# Altium schematic sheet Connectors.SchDoc
size A
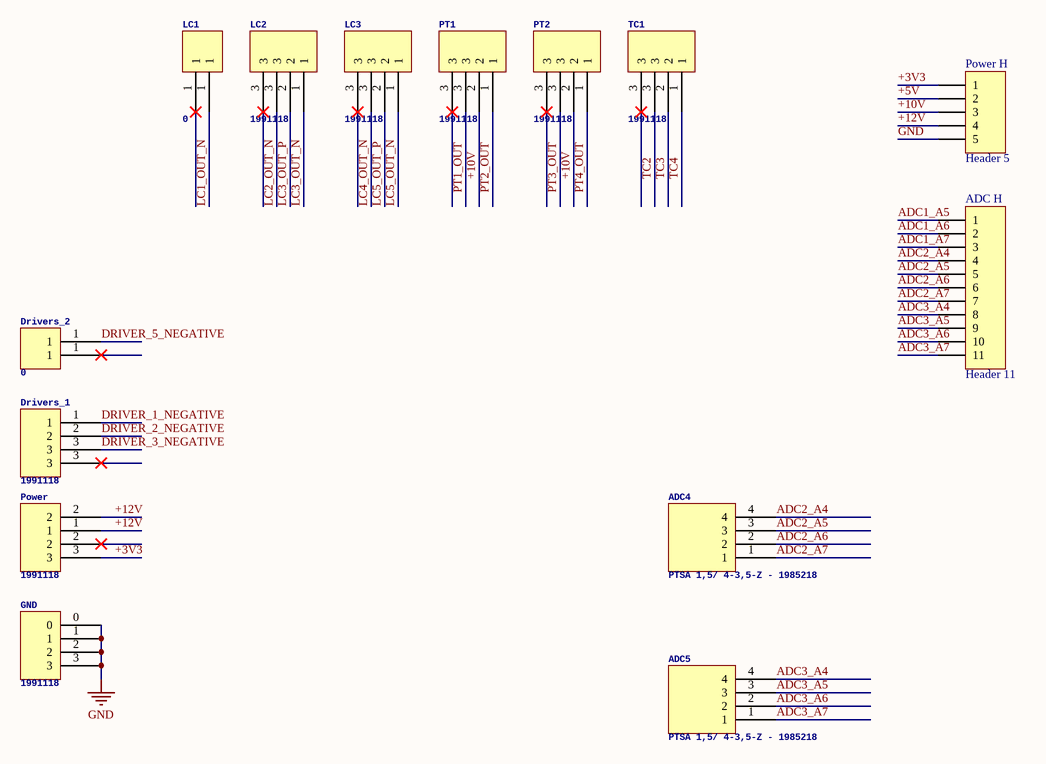
[diagram p0: Connectors.SchDoc]

## Parts
ADC4  PTSA 1,5/ 4-3,5-Z - 1985218
ADC5  PTSA 1,5/ 4-3,5-Z - 1985218
ADC_H  Header 11  [HDR1X11]
Drivers_1  1991118
Drivers_2  0
GND  1991118
LC1  0
LC2  1991118
LC3  1991118
Power  1991118
Power_H  Header 5  [HDR1X5]
PT1  1991118
PT2  1991118
TC1  1991118

## Nets
GND: GND.0 GND.1 GND.2 GND.3 Power_H.5
+3V3: Power.3 Power_H.1
+5V: Power_H.2
+10V: Power_H.3 PT1.2 PT2.2
+12V: Power.1 Power.2 Power_H.4
ADC1_A5: ADC_H.1
ADC1_A6: ADC_H.2
ADC1_A7: ADC_H.3
ADC2_A4: ADC4.4 ADC_H.4
ADC2_A5: ADC4.3 ADC_H.5
ADC2_A6: ADC4.2 ADC_H.6
ADC2_A7: ADC4.1 ADC_H.7
ADC3_A4: ADC5.4 ADC_H.8
ADC3_A5: ADC5.3 ADC_H.9
ADC3_A6: ADC5.2 ADC_H.10
ADC3_A7: ADC5.1 ADC_H.11
DRIVER_1_NEGATIVE: Drivers_1.1
DRIVER_2_NEGATIVE: Drivers_1.2
DRIVER_3_NEGATIVE: Drivers_1.3
DRIVER_5_NEGATIVE: Drivers_2.1
LC1_OUT_N: LC1.1
LC2_OUT_N: LC2.3
LC3_OUT_N: LC2.1
LC3_OUT_P: LC2.2
LC4_OUT_N: LC3.3
LC5_OUT_N: LC3.1
LC5_OUT_P: LC3.2
PT1_OUT: PT1.3
PT2_OUT: PT1.1
PT3_OUT: PT2.3
PT4_OUT: PT2.1
TC2: TC1.3
TC3: TC1.2
TC4: TC1.1

## Library data of the parts
ADC4 ADC5 = PTSA 1,5/ 4-3,5-Z - 1985218: Phoenix Contact PCB Terminal Spring Cage Clamp + Button 4 pos
ADC_H = Header 11: Header, 11-Pin; LatestRevisionDate: 17-Jul-2002; LatestRevisionNote: Re-released for DXP Platform.; Publisher: Altium Limited
Drivers_2 LC1 = 1991095: Phoenix Contact Connector PCB Terminal 2 port
Power_H = Header 5: Header, 5-Pin; LatestRevisionDate: 17-Jul-2002; LatestRevisionNote: Re-released for DXP Platform.; Publisher: Altium Limited